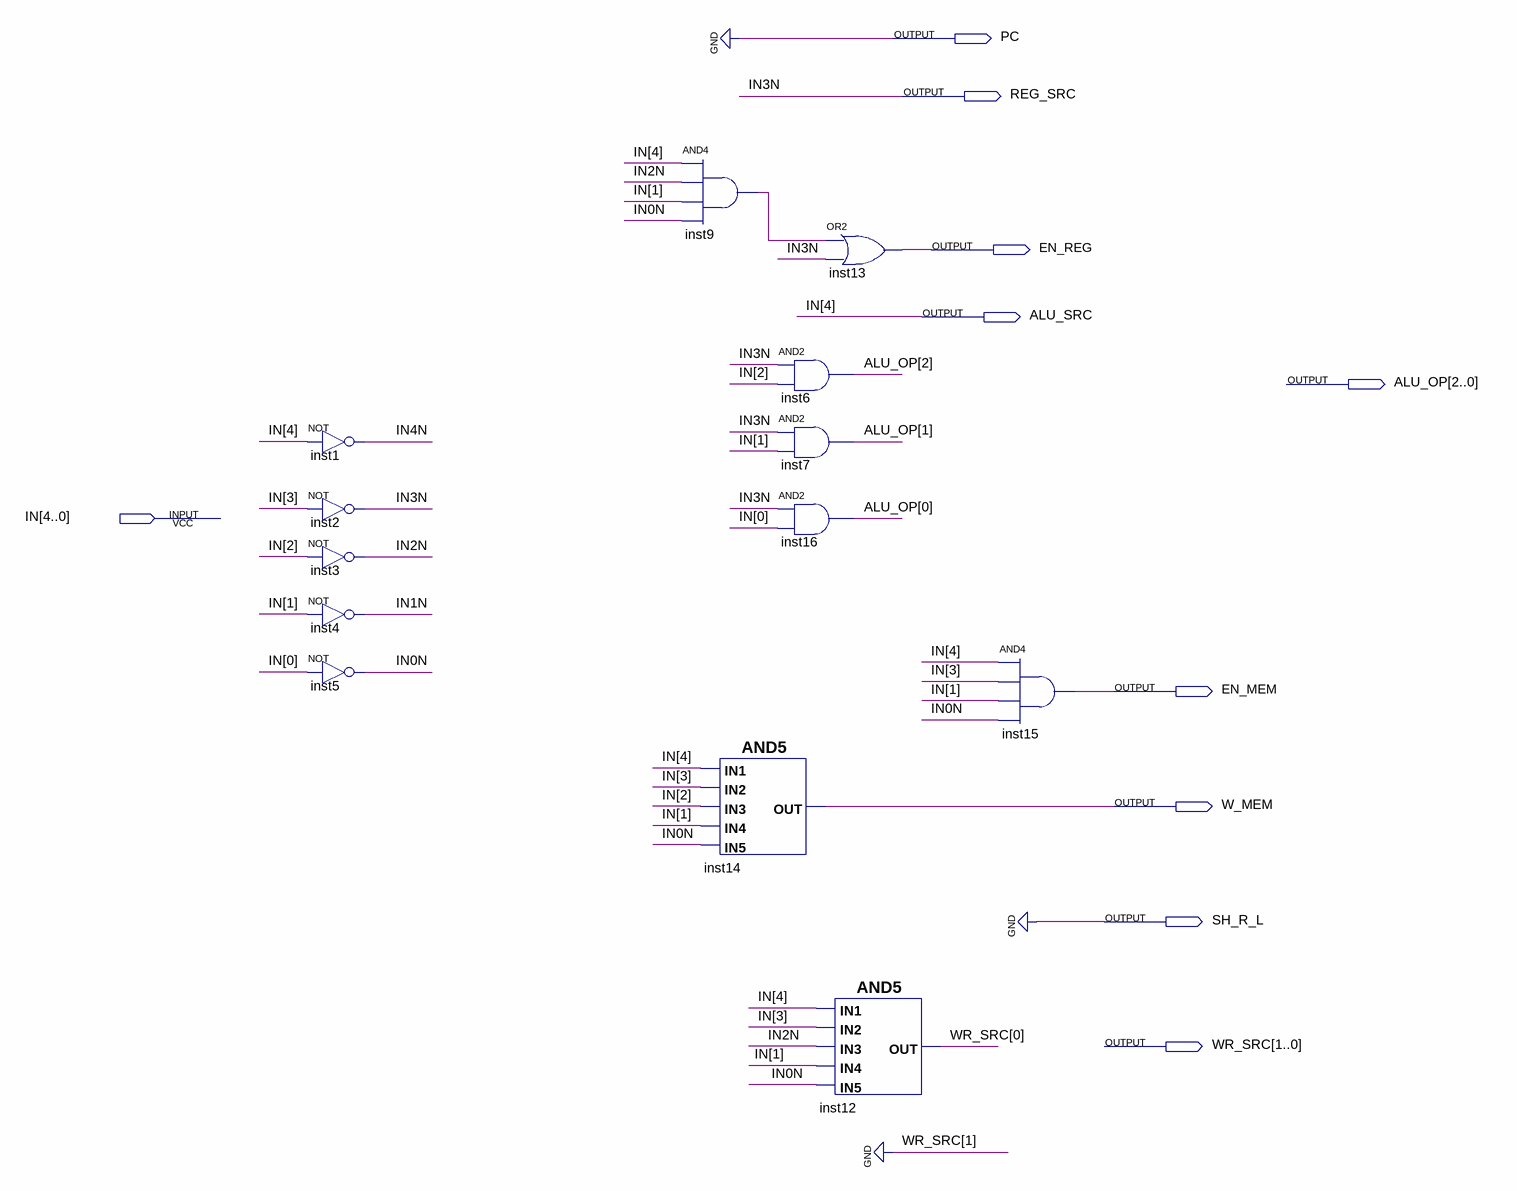
[diagram p0: schematic sheet]
// Quartus schematic TEST_CT.bdf as structural Verilog: 13 symbols, 10 pins
module TEST_CT (
  input  [4:0] IN,
  output PC,
  output REG_SRC,
  output EN_REG,
  output ALU_SRC,
  output [2:0] ALU_OP,
  output EN_MEM,
  output W_MEM,
  output SH_R_L,
  output [1:0] WR_SRC
);

  wire IN0N, IN1N, IN2N, IN4N, inst9_out;

  not inst1 (IN4N, IN[4]);
  not inst2 (REG_SRC, IN[3]);
  not inst3 (IN2N, IN[2]);
  not inst4 (IN1N, IN[1]);
  not inst5 (IN0N, IN[0]);
  and inst9 (inst9_out, IN[4], IN2N, IN[1], IN0N);
  and inst14 (W_MEM, IN[4], IN[3], IN[2], IN[1], IN0N);
  or inst13 (EN_REG, inst9_out, REG_SRC);
  and inst6 (ALU_OP[2], REG_SRC, IN[2]);
  and inst7 (ALU_OP[1], REG_SRC, IN[1]);
  and inst16 (ALU_OP[0], REG_SRC, IN[0]);
  and inst12 (WR_SRC[0], IN[4], IN[3], IN2N, IN[1], IN0N);
  and inst15 (EN_MEM, IN[4], IN[3], IN[1], IN0N);

  assign ALU_SRC = IN[4];
  assign PC = 1'b0;
  assign SH_R_L = 1'b0;
  assign WR_SRC[1] = 1'b0;

  // Other names for the same wires on the sheet: IN3N = REG_SRC
endmodule
